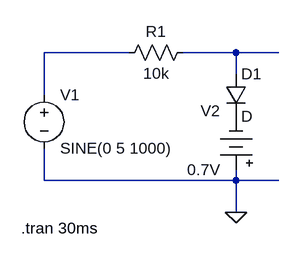
[diagram p0: schematic positive clipper.asc]
positive clipper.asc, the LTspice schematic file:
Version 4
SHEET 1 880 680
WIRE 144 -16 16 -16
WIRE 304 -16 224 -16
WIRE 368 -16 304 -16
WIRE 304 16 304 -16
WIRE 16 48 16 -16
WIRE 16 176 16 128
WIRE 304 176 304 160
WIRE 304 176 16 176
WIRE 368 176 304 176
WIRE 304 224 304 176
FLAG 304 224 0
SYMBOL res 240 -32 R90
WINDOW 0 0 56 VBottom 2
WINDOW 3 32 56 VTop 2
SYMATTR InstName R1
SYMATTR Value 10k
SYMBOL voltage 16 32 R0
WINDOW 123 0 0 Left 0
WINDOW 39 0 0 Left 0
SYMATTR InstName V1
SYMATTR Value SINE(0 5 1000)
SYMBOL diode 288 16 R0
SYMATTR InstName D1
SYMBOL Misc\\battery 304 176 R180
WINDOW 0 24 104 Left 2
WINDOW 3 24 16 Left 2
WINDOW 123 0 0 Left 0
WINDOW 39 0 0 Left 0
SYMATTR InstName V2
SYMATTR Value 0.7V
TEXT -18 248 Left 2 !.tran 30ms

The netlist it stands for:
* positive clipper.asc
R1 N002 N001 10k
V1 N001 0 SINE(0 5 1000)
D1 N002 P001 D
V2 0 P001 0.7V
.model D D
.lib standard.dio
.tran 30ms
.backanno
.end